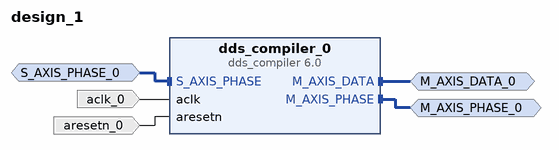
[diagram p0: block diagram of the top level]
# Vivado block design design_1, xc7z020clg400-1, Vivado 2019.1.2
create_bd_design design_1

create_bd_intf_port -mode Master -vlnv xilinx.com:interface:axis_rtl:1.0 M_AXIS_DATA_0
create_bd_intf_port -mode Master -vlnv xilinx.com:interface:axis_rtl:1.0 M_AXIS_PHASE_0
create_bd_intf_port -mode Slave -vlnv xilinx.com:interface:axis_rtl:1.0 S_AXIS_PHASE_0
set_property -dict [list \
  CONFIG.HAS_TKEEP 0 \
  CONFIG.HAS_TLAST 0 \
  CONFIG.HAS_TREADY 0 \
  CONFIG.HAS_TSTRB 0 \
  CONFIG.LAYERED_METADATA undef \
  CONFIG.TDATA_NUM_BYTES 2 \
  CONFIG.TDEST_WIDTH 0 \
  CONFIG.TID_WIDTH 0 \
  CONFIG.TUSER_WIDTH 0 \
] [get_bd_intf_ports S_AXIS_PHASE_0]
create_bd_port -dir I -type clk aclk_0
create_bd_port -dir I -type rst aresetn_0

create_bd_cell -type ip -vlnv xilinx.com:ip:dds_compiler:6.0 dds_compiler_0
set_property -dict [list \
  CONFIG.DATA_Has_TLAST Not_Required \
  CONFIG.Has_ARESETn true \
  CONFIG.Latency 3 \
  CONFIG.Noise_Shaping None \
  CONFIG.Output_Frequency1 0 \
  CONFIG.Output_Width 8 \
  CONFIG.PINC1 0 \
  CONFIG.Parameter_Entry Hardware_Parameters \
  CONFIG.Phase_Increment Streaming \
  CONFIG.Phase_Width 16 \
  CONFIG.Phase_offset None \
  CONFIG.S_PHASE_Has_TUSER Not_Required \
] [get_bd_cells dds_compiler_0]

# ---- connections ----

connect_bd_intf_net [get_bd_intf_ports M_AXIS_DATA_0] [get_bd_intf_pins dds_compiler_0/M_AXIS_DATA]
connect_bd_intf_net [get_bd_intf_ports M_AXIS_PHASE_0] [get_bd_intf_pins dds_compiler_0/M_AXIS_PHASE]
connect_bd_intf_net -intf_net S_AXIS_PHASE_0_1 [get_bd_intf_ports S_AXIS_PHASE_0] [get_bd_intf_pins dds_compiler_0/S_AXIS_PHASE]
connect_bd_net -net aclk_0_1 [get_bd_ports aclk_0] [get_bd_pins dds_compiler_0/aclk]
connect_bd_net -net aresetn_0_1 [get_bd_ports aresetn_0] [get_bd_pins dds_compiler_0/aresetn]

validate_bd_design
save_bd_design
